# EAGLE design sme360pm (EAGLE 9.6.2)
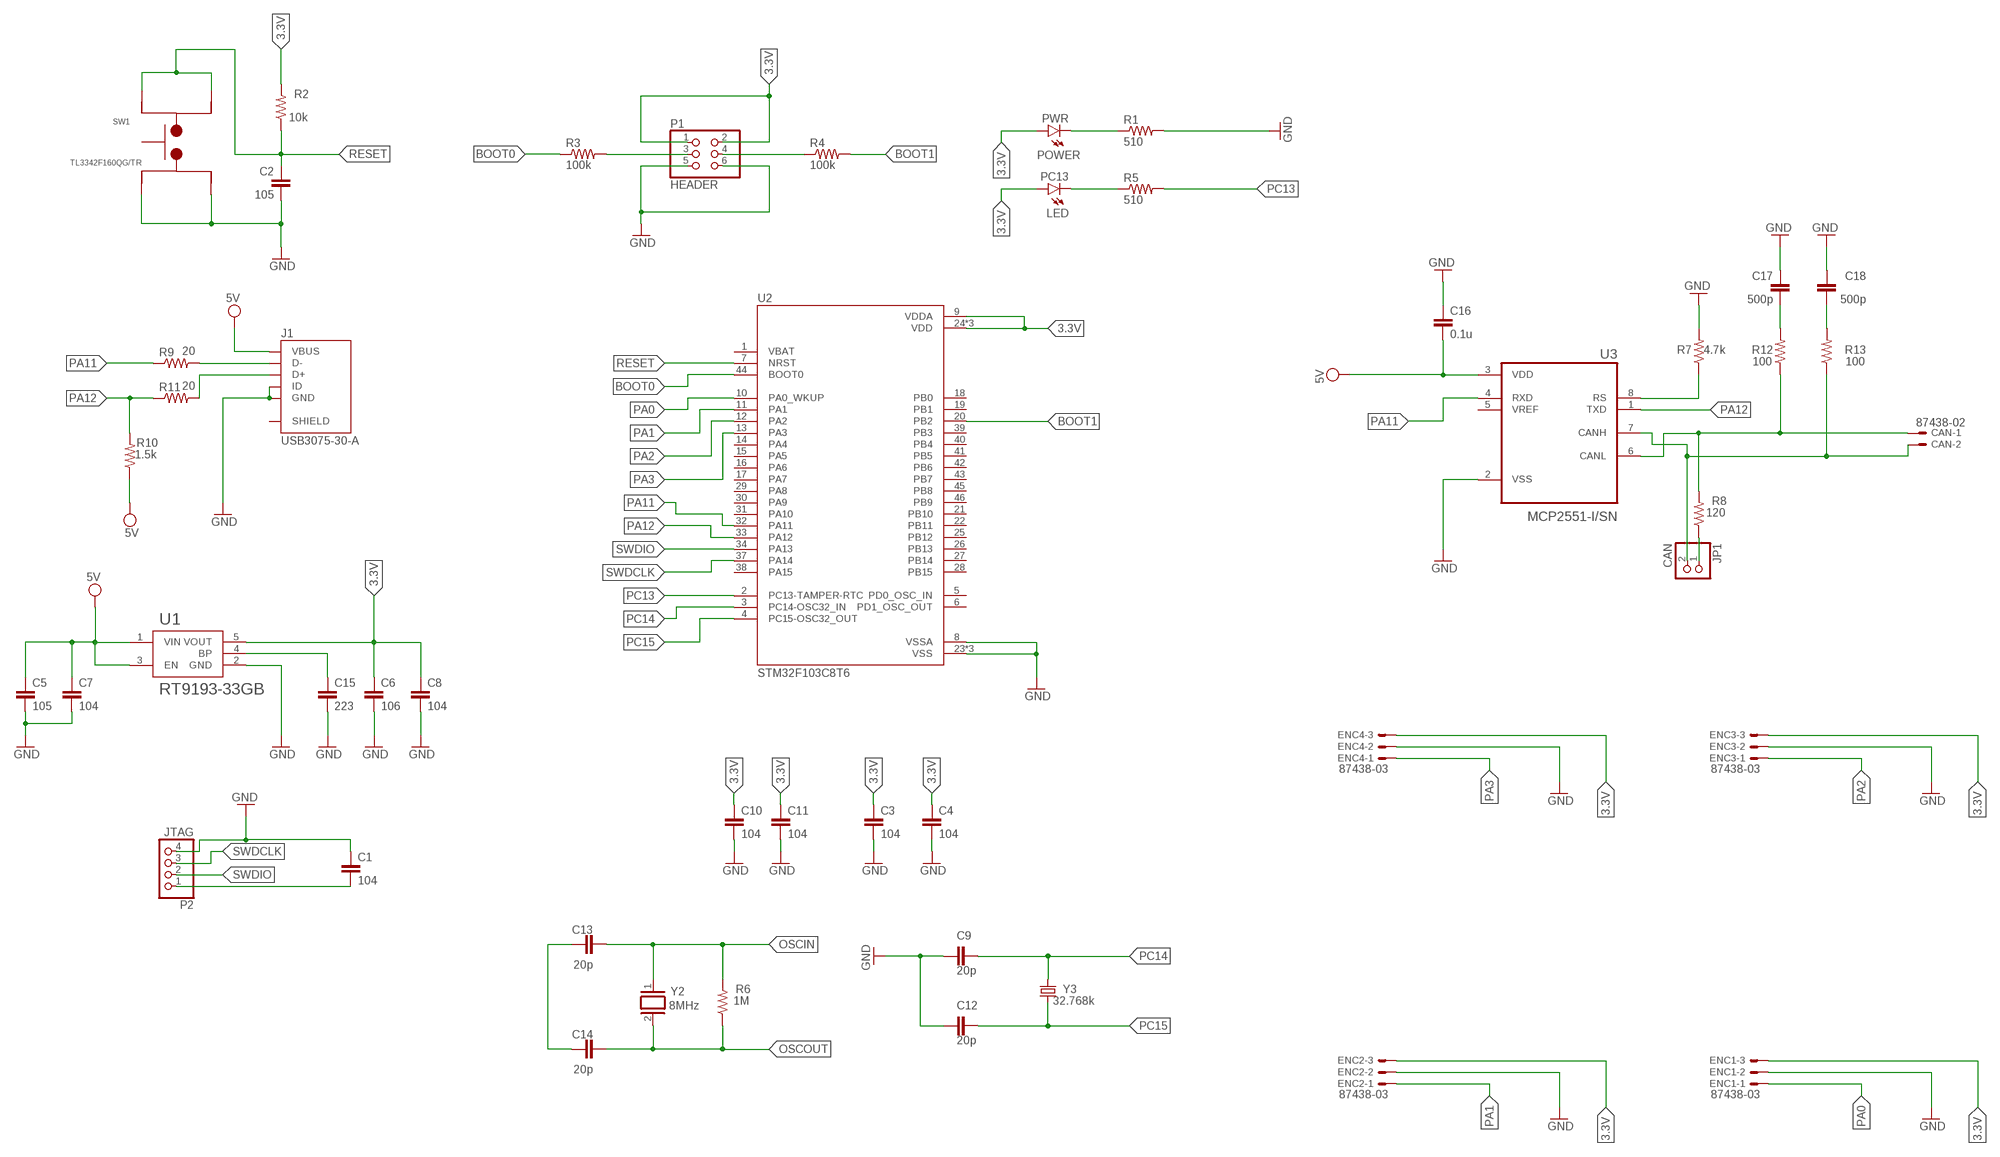
[diagram p0: schematic, sheet 1]

## Parts
C1  104  C-EUC0603  [C0603]
C2  105  C-EUC0603  [C0603]
C3  104  C-EUC0603  [C0603]
C4  104  C-EUC0603  [C0603]
C5  105  C-EUC0805  [C0805]
C6  106  C-EUC0805  [C0805]
C7  104  C-EUC0603  [C0603]
C8  104  C-EUC0603  [C0603]
C9  20p  C-EUC0603  [C0603]
C10  104  C-EUC0603  [C0603]
C11  104  C-EUC0603  [C0603]
C12  20p  C-EUC0603  [C0603]
C13  20p  C-EUC0603  [C0603]
C14  20p  C-EUC0603  [C0603]
C15  223  C-EUC0603  [C0603]
C16  0.1u  C-EUC0603  [C0603]
C17  500p  C-EUC0603  [C0603]
C18  500p  C-EUC0603  [C0603]
CAN  87438-02  [87438-02]
ENC1  87438-03  [87438-03]
ENC2  87438-03  [87438-03]
ENC3  87438-03  [87438-03]
ENC4  87438-03  [87438-03]
J1  USB3075-30-A  [GCT_USB3075-30-A]
JP1  CAN  PINHD-1X2  [1X02]
P1  HEADER  PINHD-2X3  [2X03]
P2  JTAG  PINHD-1X4  [1X04]
PC13  LED  LEDCHIP-LED0603  [CHIP-LED0603]
PWR  POWER  LEDCHIP-LED0603  [CHIP-LED0603]
R1  510  R-US_R0603  [R0603]
R2  10k  R-US_R0603  [R0603]
R3  100k  R-US_R0603  [R0603]
R4  100k  R-US_R0603  [R0603]
R5  510  R-US_R0603  [R0603]
R6  1M  R-US_R0603  [R0603]
R7  4.7k  R-US_R0603  [R0603]
R8  120  R-US_R0805  [R0805]
R9  20  R-US_R0603  [R0603]
R10  1.5k  R-US_R0603  [R0603]
R11  20  R-US_R0603  [R0603]
R12  100  R-US_R0603  [R0603]
R13  100  R-US_R0603  [R0603]
SW1  TL3342F160QG/TR  [SW_TL3342F160QG/TR]
U1  RT9193-33GB  [SOT94P279X129-5N]
U2  STM32F103C8T6  [QFP50P900X900X160-48N]
U3  MCP2551-I/SN  [SOIC127P599X175-8N]
Y2  8MHz  XTAL/S  [QS]
Y3  32.768k  KX-327-S  [8.2X3.8]

## Nets
3.3V: C3.1 C4.1 C6.1 C8.1 C10.1 C11.1 ENC1.3 ENC2.3 ENC3.3 ENC4.3 P1.1 P1.2 PC13.A PWR.A R2.2 U1.5(VOUT) U2.9(VDDA) U2.24(VDD) U2.36(VDD) U2.48(VDD)
BOOT0: R3.1 U2.44(BOOT0)
BOOT1: R4.2 U2.20(PB2)
GND: C1.1 C2.1 C3.2 C4.2 C5.2 C6.2 C7.2 C8.2 C9.2 C10.2 C11.2 C12.2 C15.2 C16.1 C17.2 C18.2 ENC1.2 ENC2.2 ENC3.2 ENC4.2 J1.4(ID) J1.5(GND) P1.5 P1.6 P2.4 R1.2 R7.2 SW1.1 SW1.2 U1.2(GND) U2.8(VSSA) U2.23(VSS) U2.35(VSS) U2.47(VSS) U3.2(VSS)
N$1: J1.2(D-) R9.2
N$2: J1.3(D+) R11.2
N$3: PWR.C R1.1
N$4: C15.1 U1.4(BP)
N$5: C13.1 C14.1
N$6: PC13.C R5.1
N$7: C1.2 P2.1
N$8: P1.3 R3.2
N$9: P1.4 R4.1
N$10: R7.1 U3.8(RS)
N$11: CAN.1 R8.2 R12.1 U3.6(CANL)
N$12: JP1.1 R8.1
N$13: CAN.2 JP1.2 R13.1 U3.7(CANH)
N$14: C17.1 R12.2
N$15: C18.1 R13.2
OSCIN: C13.2 R6.2 Y2.1
OSCOUT: C14.2 R6.1 Y2.2
PA0: ENC1.1 U2.10(PA0_WKUP)
PA1: ENC2.1 U2.11(PA1)
PA2: ENC3.1 U2.12(PA2)
PA3: ENC4.1 U2.13(PA3)
PA11: R9.1 U2.32(PA11) U3.4(RXD)
PA12: R10.2 R11.1 U2.33(PA12) U3.1(TXD)
PC13: R5.2 U2.2(PC13-TAMPER-RTC)
PC14: C9.1 U2.3(PC14-OSC32_IN) Y3.4
PC15: C12.1 U2.4(PC15-OSC32_OUT) Y3.1
RESET: C2.2 R2.1 SW1.3 SW1.4 U2.7(NRST)
SWDCLK: P2.3 U2.37(PA14)
SWDIO: P2.2 U2.34(PA13)
VCC: C5.1 C7.1 C16.2 J1.1(VBUS) R10.1 U1.1(VIN) U1.3(EN) U3.3(VDD) ; supply symbol labelled 5V
Unconnected: J1.S1(SHIELD) J1.S2(SHIELD) J1.S3(SHIELD) J1.S4(SHIELD) J1.S5(SHIELD) J1.S6(SHIELD) U2.1(VBAT) U2.5(PD0_OSC_IN) U2.6(PD1_OSC_OUT) U2.14(PA4) U2.15(PA5) U2.16(PA6) U2.17(PA7) U2.18(PB0) U2.19(PB1) U2.21(PB10) U2.22(PB11) U2.25(PB12) U2.26(PB13) U2.27(PB14) U2.28(PB15) U2.29(PA8) U2.30(PA9) U2.31(PA10) U2.38(PA15) U2.39(PB3) U2.40(PB4) U2.41(PB5) U2.42(PB6) U2.43(PB7) U2.45(PB8) U2.46(PB9) U3.5(VREF)

## Library data of the parts
C1-C18 = rcl:C-EU: CAPACITOR, European symbol; SPICEPREFIX: C
CAN = con-molex:87438-02: Wire-to-Board 1.50mm (.059") Pitch Header - Right Angle, SMT, Shrouded Source: http://www.molex.com/product/micro/87438.html; MF: MOLEX; OC_FARNELL: 1711327; OC_NEWARK: unknown
ENC1-ENC4 = con-molex:87438-03: Wire-to-Board 1.50mm (.059") Pitch Header - Right Angle, SMT, Shrouded Source: http://www.molex.com/product/micro/87438.html; MF: MOLEX; OC_FARNELL: 1711328; OC_NEWARK: unknown
J1 = USB3075-30-A:USB3075-30-A: Micro USB Receptacle, Type B, 5 Pin, SMT, Horizontal, Bottom Mount (Standart), without Peg, with Outer Shell Stakes Check availability <https://pricing.snapeda.com/parts/USB3075-30-A/Global%20Connector%20Technology/view-part?ref=eda>; AVAILABILITY: In Stock; DESCRIPTION: USB - micro B USB 2.0 Receptacle Connector 5 Position Surface Mount, Right Angle; Through Hole, 2.35mm profile, 5 Pins, Horizontal, Bottom mount; MF: Global Connector Technology; MP: USB3075-30-A; PACKAGE: None; PRICE: None; PURCHASE-URL: https://pricing.snapeda.com/search/part/USB3075-30-A/?ref=eda
JP1 = pinhead:PINHD-1X2: PIN HEADER
P1 = pinhead:PINHD-2X3: PIN HEADER
P2 = pinhead:PINHD-1X4: PIN HEADER
PC13 PWR = led:LED: LED OSRAM: - CHIPLED LG R971, LG N971, LY N971, LG Q971, LY Q971, LO R971, LY R971 LH N974, LH R974 LS Q976, LO Q976, LY Q976 LO Q996 - Hyper CHIPLED LW Q18S LB Q993, LB Q99A, LB R99A - SideLED LS A670, LO A670, LY A670, LG A670, LP A670 LB A673, LV A673, LT A673, LW A673 LH A674 LY A675 LS A676, LA A676, LO A676, LY A676, LW A676 LS A679, LY A679, LG A679 - Hyper Micro SIDELED® LS Y876, LA Y876, LO Y876, LY Y876 LT Y87S - SmartLED LW L88C, LW L88S LB L89C, LB L89S, LG L890 LS L89K, LO L89K, LY L89K LS L896, LA L896, LO L896, LY L896 - TOPLED LS T670, LO T670, LY T670, LG T670, LP T670 LSG T670, LSP T670, LSY T670, LOP T670, LYG T670 LG T671, LOG T671, LSG T671 LB T673, LV T673, LT T673, LW T673 LH T674 LS T676, LA T676, LO T676, LY T676, LB T676, LH T676, LSB T676, LW T676 LB T67C, LV T67C, LT T67C, LS T67K, LO T67K, LY T67K, LW E67C LS E67B, LA E67B, LO E67B, LY E67B, LB E67C, LV E67C, LT E67C LW T67C LS T679, LY T679, LG T679 LS T770, LO T770, LY T770, LG T770, LP T770 LB T773, LV T773, LT T773, LW T773 LH T774 LS E675, LA E675, LY E675, LS T675 LS T776, LA T776, LO T776, LY T776, LB T776 LHGB T686 LT T68C, LB T68C - Hyper Mini TOPLED® LB M676 - Mini TOPLED Santana® LG M470 LS M47K, LO M47K, LY M47K Source: http://www.osram.convergy.de LUXEON: - LUMILED® LXK2-PW12-R00, LXK2-PW12-S00, LXK2-PW14-U00, LXK2-PW14-V00 LXK2-PM12-R00, LXK2-PM12-S00, LXK2-PM14-U00 LXK2-PE12-Q00, LXK2-PE12-R00, LXK2-PE12-S00, LXK2-PE14-T00, LXK2-PE14-U00 LXK2-PB12-K00, LXK2-PB12-L00, LXK2-PB12-M00, LXK2-PB14-N00, LXK2-PB14-P00, LXK2-PB14-Q00 LXK2-PR12-L00, LXK2-PR12-M00, LXK2-PR14-Q00, LXK2-PR14-R00 LXK2-PD12-Q00, LXK2-PD12-R00, LXK2-PD12-S00 LXK2-PH12-R00, LXK2-PH12-S00 LXK2-PL12-P00, LXK2-PL12-Q00, LXK2-PL12-R00 Source: www.luxeon.com KINGBRIGHT: KA-3528ASYC Source: www.kingbright.com
R1-R13 = rcl:R-US_: RESISTOR, American symbol; SPICEPREFIX: R
SW1 = TL3342F160QG_TR:TL3342F160QG/TR: TL3342 Series SPST 1.6 N Round Button Gull Wing Surface Mount Tactile Switch Check availability <https://pricing.snapeda.com/parts/TL3342F160QG/TR/E-Switch/view-part?ref=eda>; AVAILABILITY: In Stock; DESCRIPTION: Tactile Switch SPST-NO Top Actuated Surface Mount; MF: E-Switch; MP: TL3342F160QG/TR; PACKAGE: None; PRICE: None; PURCHASE-URL: https://pricing.snapeda.com/search/part/TL3342F160QG/TR/?ref=eda
U1 = RT9193-33GB:RT9193-33GB: RT9193 Series 300 mA 3.3 V Ultra-Low Noise Ultra-Fast CMOS LDO Regulator-SC-70-5 Check availability <https://pricing.snapeda.com/parts/RT9193-33GB/Richtek%20USA%20Inc./view-part?ref=eda>; AVAILABILITY: In Stock; DESCRIPTION: Linear Voltage Regulator IC Positive Fixed 1 Output 300mA SOT-23-5; MF: Richtek USA Inc.; MP: RT9193-33GB; PACKAGE: SOT-23-5 Richtek; PRICE: None; PURCHASE-URL: https://pricing.snapeda.com/search/part/RT9193-33GB/?ref=eda
U2 = STM32F103C8T6:STM32F103C8T6: Mainstream Performance line, ARM Cortex-M3 MCU with 64 Kbytes Flash, 72 MHz CPU, motor control, USB and CAN Check availability <https://pricing.snapeda.com/parts/STM32F103C8T6/STMicroelectronics/view-part?ref=eda>; AVAILABILITY: In Stock; DESCRIPTION: ARM® Cortex®-M3 STM32F1 Microcontroller IC 32-Bit 72MHz 64KB (64K x 8) FLASH 48-LQFP (7x7); MF: STMicroelectronics; MP: STM32F103C8T6; PACKAGE: LQFP-48 STMicroelectronics; PRICE: None; PURCHASE-URL: https://pricing.snapeda.com/search/part/STM32F103C8T6/?ref=eda
U3 = MCP2551-I_SN:MCP2551-I/SN: Check availability <https://pricing.snapeda.com/parts/MCP2551-I/SN/Microchip/view-part?ref=eda>; AVAILABILITY: In Stock; DESCRIPTION: 1/1 Transceiver Half CANbus 8-SOIC; MF: Microchip; MP: MCP2551-I/SN; PACKAGE: SOIC-8 Microchip; PRICE: None; PURCHASE-URL: https://pricing.snapeda.com/search/part/MCP2551-I/SN/?ref=eda
Y2 = special:XTAL/S: CRYSTAL
Y3 = crystal-geyer_V1_0:KX-327: Tuning Fork Crystals (kHz) SMD: KX327 - Serie Model Size l/w/h [mm] Frequency Range Frequency Stability Temp. Range [°C] Load Capacitance AECQ 200 availabel Datasheet KX-327VT KX-327FT KX-327RT KX-327NHT KX-327NHF KX-327L KX-327S 1.25/1.05/0.5 1.6/1.0/0.5 2.0/1.2/0.6 3.2/1.5/0.8 3.2/1.5/0.8 7.0/1.5/1.4 8.2/3.8/2.5 32,768 kHz 32,768 kHz 32,768 kHz 32,768 kHz 32,768 kHz 32,768 kHz 32,768 kHz ±10 … ±20ppm ±10 … ±20ppm ±10 … ±20ppm ±10 … ±20ppm ±10 … ±20ppm ±10 … ±20ppm ±5 … ±20ppm (*) -40°C …+85°C (*) -40°C …+85°C (*) -40°C …+85°C (*) -40°C …+85°C (*) -40°C …+125°C (*) -40°C …+85°C (*) -40°C …+85°C 7/9/12,5 7/9/12,5 7/9/12,6 7/9/12,5 9/12,5 7/9/12,5 6/12,5 - - - - yes - - KX-327VT.pdf <http://www.geyer-electronic.de/uploads/tx_userartikelfrequenz/GEYER-KX-327VT.pdf> KX-327FT.pdf <http://www.geyer-electronic.de/uploads/tx_userartikelfrequenz/GEYER-KX-327FT.pdf> KX-327RT.pdf <http://www.geyer-electronic.de/uploads/tx_userartikelfrequenz/GEYER-KX-327RT.pdf> KX-327NHT.pdf <http://www.geyer-electronic.de/uploads/tx_userartikelfrequenz/GEYER-KX-327NHT.pdf> KX-327NHF.pdf <http://www.geyer-electronic.de/uploads/tx_userartikelfrequenz/GEYER-KX-327NHF.pdf> KX-327L.pdf <http://www.geyer-electronic.de/uploads/tx_userartikelfrequenz/GEYER-KX-327L.pdf> KX-327S.pdf <http://www.geyer-electronic.de/uploads/tx_userartikelfrequenz/GEYER-KX-327S.pdf> <http://www.geyer-electronic.de/fileadmin/template/img/logo-geyer-electronic.png> Details see: http://www.geyer-electronic.de/Frequenz-Produkte.9.0.html Created 2016-06-07, Hans Locher 2016 (C) Geyer Quartz Technology KX327VT,KX327FT,KX327RT,KX327NHT,KX327NHF,KX327S,KX327L;125105;1610;2012;3215;7015;8238;1,25x1,05,1.25x1.05;1,6x1,0,1.6x1.0;2,0x1,2,2.0x1.2;3,2x1,5,3.2x1.5;8,2x3,8,8.2x3.8,7.0x1.5,7,0x1,532.768kHz

## Board
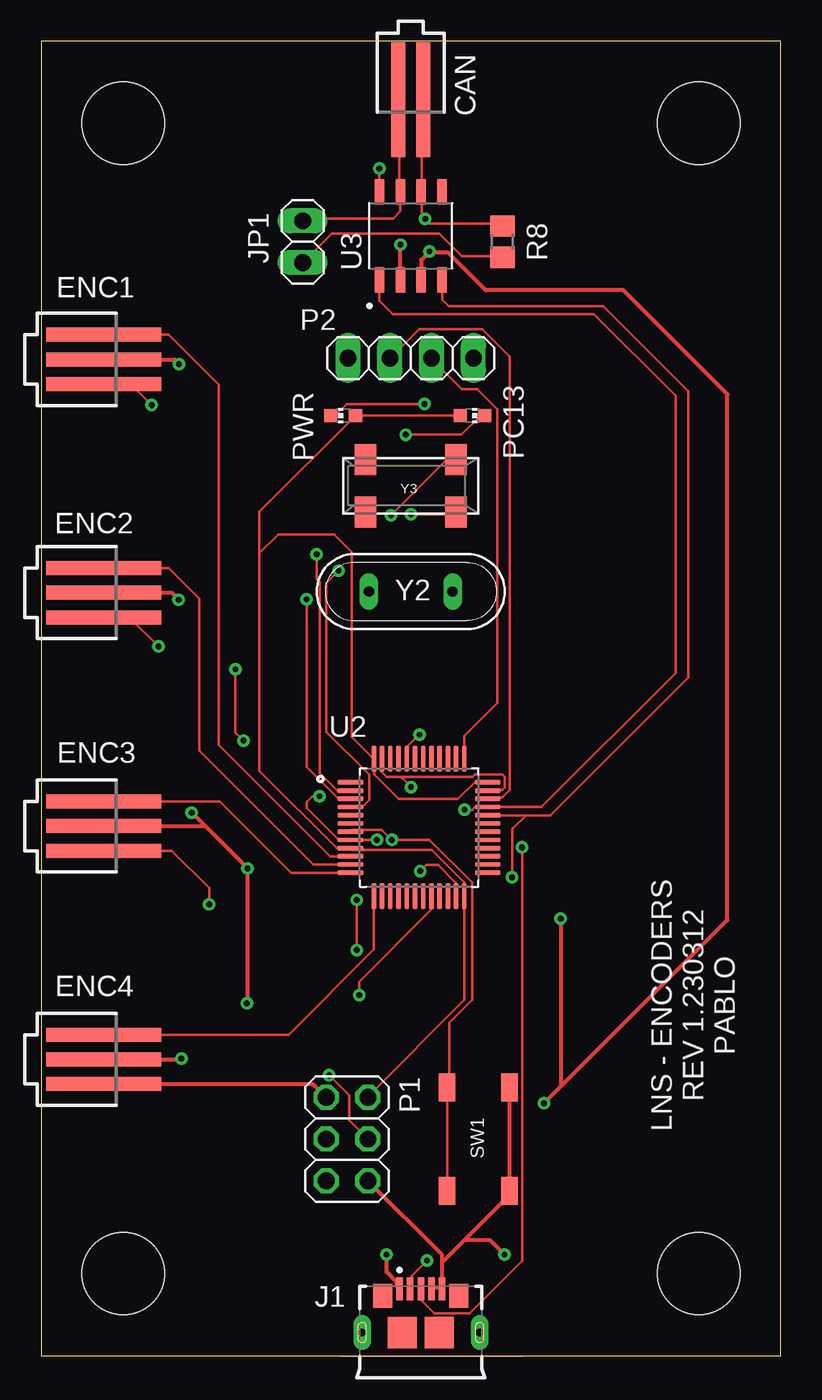
[diagram p1: board, top side]
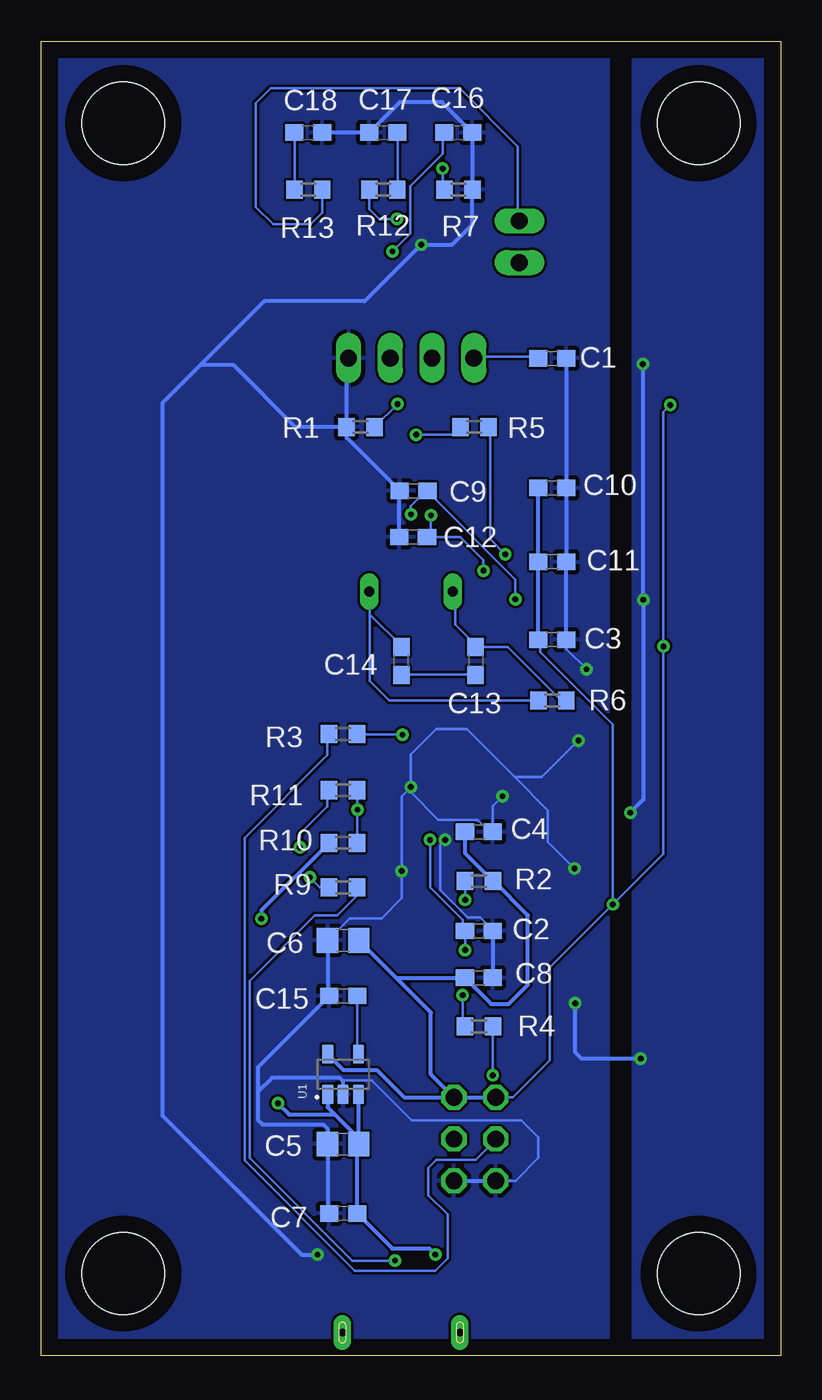
[diagram p2: board, bottom side, seen from below]

Size 45 x 80 mm. Coordinates in mm from the lower left corner, seen from the top.
Outline: 0,0 45,0 45,80 0,80 0,0
Copper layers (1*16): Top 0.035mm / dielectric 1.5mm / Bottom 0.035mm
Design rules "default": minimum track width 6mil, minimum drill 0.35mm, track to track 6mil, track to pad 6mil, pad to pad 6mil, via to via 6mil, smd to smd 6mil, copper to edge 40mil, drill to drill 6mil, minimum pad ring 10mil, minimum via ring 8mil, stop-mask expansion 4mil, vias tented up to drill 0mil, thermal gap 10mil
Holes 5 mm at 5,75 40,75 40,5 5,5

### Footprints (pad centres in the part's own frame; a part is rotated, then mirrored left to right if it is on the bottom)
C0603 = smd 1.1 x 1: 1 -0.85,0; 2 0.85,0
C0805 = smd 1.3 x 1.5: 1 -0.95,0; 2 0.95,0
87438-02 = smd 7 x 0.85: 1 0,0.75; 2 0,-0.75
87438-03 = smd 7 x 0.85: 1 0,1.5; 2 0,0; 3 0,-1.5
GCT_USB3075-30-A = smd 0.4 x 1.4: 1 0,0; 2 0.65,0; 3 1.3,0; 4 1.95,0; 5 2.6,0 | smd 1.15 x 1.45: S1 -1.02,-0.42; S2 3.62,-0.42 | smd 1.75 x 1.9: S3 0.175,-2.65; S4 2.425,-2.65 | drill 0.45 pad 1.05 long: S5 -2.275,-2.65; S6 4.875,-2.65
1X02 = drill 1.016 long: 1 -1.27,0; 2 1.27,0
2X03 = drill 1.016 octagon: 1 -2.54,-1.27; 2 -2.54,1.27; 3 0,-1.27; 4 0,1.27; 5 2.54,-1.27; 6 2.54,1.27
1X04 = drill 1.016 long: 1 -3.81,0; 2 -1.27,0; 3 1.27,0; 4 3.81,0
CHIP-LED0603 = smd 0.8 x 0.8: A 0,-0.75; C 0,0.75
R0603 = smd 1 x 1.1: 1 -0.85,0; 2 0.85,0
R0805 = smd 1.3 x 1.5: 1 -0.95,0; 2 0.95,0
SW_TL3342F160QG/TR = smd 1.7 x 1: 1 -3.15,-1.9; 2 3.15,-1.9; 3 -3.15,1.9; 4 3.15,1.9
SOT94P279X129-5N = smd 1.17 x 0.67: 1 -1.22,0.94; 2 -1.22,0; 3 -1.22,-0.94; 4 1.22,-0.94; 5 1.22,0.94
QFP50P900X900X160-48N = smd 1.56 x 0.28: 1 -4.18,2.75; 2 -4.18,2.25; 3 -4.18,1.75; 4 -4.18,1.25; 5 -4.18,0.75; 6 -4.18,0.25; 7 -4.18,-0.25; 8 -4.18,-0.75; 9 -4.18,-1.25; 10 -4.18,-1.75; 11 -4.18,-2.25; 12 -4.18,-2.75; 25 4.18,-2.75; 26 4.18,-2.25; 27 4.18,-1.75; 28 4.18,-1.25; 29 4.18,-0.75; 30 4.18,-0.25; 31 4.18,0.25; 32 4.18,0.75; 33 4.18,1.25; 34 4.18,1.75; 35 4.18,2.25; 36 4.18,2.75 | smd 0.28 x 1.56: 13 -2.75,-4.18; 14 -2.25,-4.18; 15 -1.75,-4.18; 16 -1.25,-4.18; 17 -0.75,-4.18; 18 -0.25,-4.18; 19 0.25,-4.18; 20 0.75,-4.18; 21 1.25,-4.18; 22 1.75,-4.18; 23 2.25,-4.18; 24 2.75,-4.18; 37 2.75,4.18; 38 2.25,4.18; 39 1.75,4.18; 40 1.25,4.18; 41 0.75,4.18; 42 0.25,4.18; 43 -0.25,4.18; 44 -0.75,4.18; 45 -1.25,4.18; 46 -1.75,4.18; 47 -2.25,4.18; 48 -2.75,4.18
SOIC127P599X175-8N = smd 1.58 x 0.6: 1 -2.67,1.905; 2 -2.67,0.635; 3 -2.67,-0.635; 4 -2.67,-1.905; 5 2.67,-1.905; 6 2.67,-0.635; 7 2.67,0.635; 8 2.67,1.905
QS = drill 0.61 long: 1 -2.54,0; 2 2.54,0
8.2X3.8 = smd 1.3 x 1.9: 1 -2.75,-1.6; 2 2.75,-1.6; 3 2.75,1.6; 4 -2.75,1.6

### Placement (x,y rotation side)
C1  13.91,60.7 180 bottom
C2  18.36,25.85 180 bottom
C3  13.9,43.58 0 bottom
C4  18.36,31.88 0 bottom
C5  26.63,12.89 180 bottom
C6  26.63,25.27 180 bottom
C7  26.63,8.66 180 bottom
C8  18.36,23 0 bottom
C9  22.34,52.64 180 bottom
C10  13.9,52.8 0 bottom
C11  13.9,48.31 0 bottom
C12  22.37,49.82 180 bottom
C13  18.56,42.28 90 bottom
C14  23.08,42.28 90 bottom
C15  26.63,21.9 180 bottom
C16  19.62,74.43 180 bottom
C17  24.18,74.43 180 bottom
C18  28.75,74.43 0 bottom
CAN  22.49,76.42 270 top
ENC1  3.81,60.63 0 top
ENC2  3.81,46.43 0 top
ENC3  3.81,32.23 0 top
ENC4  3.81,18.03 0 top
J1  21.8,4.06 0 top
JP1  15.91,67.79 90 top
P1  18.61,13.18 270 top
P2  22.49,60.71 0 top
PC13  26.24,57.21 270 top
PWR  18.38,57.21 90 top
R1  25.57,56.52 180 bottom
R2  18.36,28.88 0 bottom
R3  26.63,37.84 180 bottom
R4  18.36,20.04 180 bottom
R5  18.65,56.52 0 bottom
R6  13.9,39.87 0 bottom
R7  19.62,70.96 0 bottom
R8  28.06,67.79 90 top
R9  26.63,28.49 0 bottom
R10  26.63,31.22 0 bottom
R11  26.63,34.41 180 bottom
R12  24.18,70.96 0 bottom
R13  28.75,70.96 180 bottom
SW1  26.6,13.18 90 top
U1  26.63,17.13 90 bottom
U2  22.99,32.14 0 top
U3  22.49,68.15 90 top
Y2  22.49,46.5 0 top
Y3  22.49,52.94 180 top

### Tracks (layer width: path | path; a pad name or v marks a point on that pad's centre or on a via)
3.3V  (via drill 0.35)
  Top 0.152: PC13.A PWR.A 13.29,51.36 13.29,48.85 | ENC3.3 7.95,30.73 10.22,28.46 v10.22,27.46 | ENC2.3 5.38,44.93 v7.14,43.16 | ENC1.3 5.45,59.13 v6.73,57.85 | U2.36 27.13,34.9 26.36,34.9 25.34,33.87 21.75,33.87 20.27,35.36 20.27,36.27 U2.48 20.12,36.42 18.89,37.65 18.89,48.92 17.83,49.98 14.42,49.98 13.29,48.85 | P1.2 19.96,15.85 25.76,21.64 25.76,27.89 U2.24 25.76,28.04 25.76,28.8 23.77,30.79 18.9,30.79 U2.9 17.98,30.9 13.29,35.59 13.29,48.85
  Top 0.254: ENC4.3 16.54,16.53 P1.1
  Bottom 0.152: v10.22,27.46 14.05,23.64 14.05,17.98 16.31,15.72 P1.1 | v10.22,27.46 7.14,30.54 v7.14,43.16 7.14,57.44 v6.73,57.85 | v10.22,27.46 10.22,38.42 14.63,42.82 14.63,43.43 C3.1
  Bottom 0.254: P1.2 P1.1 | U1.5 26.61,17.39 24.58,17.39 22.92,15.72 P1.2 | C10.1 C11.1 C3.1 | C4.1 19.21,30.58 R2.2 17.46,28.88 15.39,26.8 15.39,22.58 16.56,21.41 17.62,21.41 C8.1 23.41,23 C6.1 21.29,20.89 21.29,17.14 P1.2
BOOT0  (via drill 0.35)
  Top 0.152: v23.01,37.8 22.25,37.03 22.25,36.42 U2.44
  Bottom 0.152: v23.01,37.8 25.76,37.8 R3.1
BOOT1  (via drill 0.35)
  Top 0.152: v19.36,21.95 19.36,22.76 23.74,27.15 U2.20 | U2.20
  Bottom 0.152: v19.36,21.95 19.36,20.12 R4.2
GND  (via drill 0.35)
  Top 0.152: 21.96,35.2 26.21,35.2 26.36,35.36 28.04,35.36 28.19,35.2 28.19,34.59 28.04,34.44 27.28,34.44 U2.35 | 21.96,35.2 21.03,35.2 20.73,35.51 20.73,36.27 U2.47 | v20.42,31.39 18.9,31.39 U2.8 18.11,31.4 16.16,33.34 16.16,33.7 16.51,34.04 v16.93,34.04 | 21.96,35.2 21.96,35.16 v22.51,34.61 | J1.4 23.77,4.12 24.38,4.12 J1.5 | U2.23 25.24,28.78 24.16,29.86 23.42,29.86 v23.07,29.5 | v11.82,41.78 11.82,37.93 v12.32,37.44
  Top 0.254: J1.5 24.4,5.69 | 24.4,5.69 25.74,7.03 | 25.74,7.03 28.5,9.78 SW1.1 SW1.2 | 24.4,5.69 24.4,6.13 P1.6 | U3.2 21.85,67.59 v21.87,67.61 | ENC3.2 9.96,32.23 9.97,32.24 | 9.97,32.24 | 9.97,32.24 v12.56,29.65 12.56,21.49 v12.51,21.45 | ENC4.2 8.48,18.03 v8.53,18.07 | ENC2.2 7.94,46.43 v8.37,46.01 | 9.97,32.24 v9.16,33.05 | ENC1.2 8.11,60.63 v8.39,60.34 | v28.19,6.16 27.32,7.03 25.74,7.03
  Bottom 0.152: v20.42,31.39 20.73,31.09 20.73,28.34 19.05,26.67 18.29,26.67 17.53,25.91 C2.1 | 26.63,16.7 26.52,16.76 24.89,16.76 22.46,14.34 15.8,14.34 14.75,13.29 14.75,12.03 16.14,10.64 P1.5 | C6.2 26.22,26.62 24.29,26.62 23.07,27.85 v23.07,29.5 23.07,34.05 v22.51,34.61 | v12.56,29.65 14.17,31.27 14.17,33.19 16.2,35.22 | 16.2,35.22 19.11,38.13 20.97,38.13 22.51,36.6 v22.51,34.61 | v22.51,34.61 22.51,34.29 20.83,32.61 18.44,32.61 17.83,32 17.53,32 C4.2 17.51,33.46 v16.93,34.04 | C3.2 13.05,43.01 v11.82,41.78 | v12.32,37.44 14.53,35.22 16.2,35.22
  Bottom 0.254: C2.1 C8.2 | C6.2 27.58,22 C15.2 31.81,17.56 31.81,16.05 | C7.2 27.58,8.76 C5.2 27.58,13.82 27.83,14.07 31.53,14.07 31.81,14.36 31.81,16.05 | U1.2 26.63,16.7 26.85,16.92 30.94,16.92 31.81,16.05 | P1.6 P1.5 | C10.2 13.05,52.55 | 13.05,52.55 C11.2 C3.2 | C1.1 13.06,52.55 13.05,52.55 | C18.2 C17.2 23.18,76.28 20.62,76.28 C16.1 R7.2 18.77,68.84 20,67.61 v21.87,67.61 25.31,64.17 31.41,64.17 35.31,60.27 | R1.2 26.42,60.59 P2.4 | C12.2 23.22,52.61 C9.2 26.42,55.86 R1.2 | v12.51,21.45 12.51,18.47 12.12,18.07 v8.53,18.07 | v9.16,33.05 8.37,33.84 v8.37,46.01 8.39,46.04 v8.39,60.34 | 35.31,60.27 37.62,57.96 37.62,14.62 29.15,6.16 v28.19,6.16 | R1.2 29.53,56.52 33.28,60.27 35.31,60.27
  pour Bottom: 10.5,80 45,80 45,0 10.5,0
  pour Bottom: 0,80 9,80 9,1 9,0 0,0
N$1  (via drill 0.35)
  Top 0.152: v23.47,5.79 22.55,4.88 22.55,4.12 J1.2
  Bottom 0.152: R9.2 25.78,28 26.99,26.79 28.34,26.79 32.31,22.82 32.31,12.04 26.06,5.79 v23.47,5.79
N$2  (via drill 0.35)
  Top 0.152: v29.26,30.94 29.26,5.79 26.06,2.59 23.93,2.59 23.16,3.35 23.16,3.96 J1.3
  Bottom 0.152: v29.26,30.94 29.26,31.76 27.58,33.44 27.58,34.29 R11.2
N$3  (via drill 0.35)
  Top 0.152: v23.32,57.91 18.59,57.91 17.98,57.3 17.68,57.3 PWR.C
  Bottom 0.152: v23.32,57.91 24.69,56.54 R1.1
N$4
  Bottom 0.152: C15.1 25.76,21.79 25.76,18.44 U1.4
N$5
  Bottom 0.152: C13.1 18.59,41.45 23.01,41.45 C14.1
N$6  (via drill 0.35)
  Top 0.152: v22.18,56.05 25.57,56.05 26.67,57.15 26.98,57.15 PC13.C
  Bottom 0.152: R5.1 19.97,56.05 v22.18,56.05
N$7
  Bottom 0.152: C1.2 14.78,60.81 18.59,60.81 P2.1
N$8
  Bottom 0.152: R3.2 27.58,37.8 27.58,36.55 32.61,31.52 32.61,11.89 25.91,5.18 21.03,5.18 20.27,5.94 20.27,8.61 21.43,9.78 21.43,11.43 20.95,11.91 18.57,11.91 17.37,13.11 P1.3
N$9  (via drill 0.35)
  Top 0.152: v17.53,17.07 18.75,15.85 18.75,14.33 19.81,13.26 P1.4
  Bottom 0.152: v17.53,17.07 17.53,19.96 R4.1
N$10  (via drill 0.35)
  Top 0.152: v20.57,72.24 20.57,70.87 U3.8
  Bottom 0.152: v20.57,72.24 20.57,71.02 R7.1
N$11  (via drill 0.35)
  Top 0.152: R8.2 28.04,68.89 23.65,68.89 v23.36,69.18 23.16,69.37 23.16,70.71 23.16,70.72 U3.6 23.16,70.87 23.16,76.35 CAN.1
  Bottom 0.152: R12.1 25.03,69.77 24.44,69.18 v23.36,69.18
N$12
  Top 0.152: R8.1 28.04,66.9 25.6,66.9 24.23,68.28 17.68,68.28 16,66.6 JP1.1
N$13
  Top 0.152: CAN.2 21.79,76.35 21.79,70.87 U3.7 21.85,69.63 21.41,69.19 16,69.19 JP1.2
  Bottom 0.152: JP1.2 16,69.19 16,73.59 19.54,77.12 31.03,77.12 31.93,76.22 31.93,69.9 30.88,68.85 28.6,68.85 27.9,69.55 R13.1
N$14
  Bottom 0.152: R12.2 23.32,71.02 23.32,74.37 C17.1
N$15
  Bottom 0.152: R13.2 29.57,71.02 29.57,74.37 C18.1
OSCIN
  Bottom 0.152: R6.2 13.11,39.93 13.41,39.93 16.61,43.13 18.44,43.13 C13.2 18.59,43.28 19.81,44.5 19.81,46.48 Y2.1
OSCOUT
  Bottom 0.152: 24.99,45.11 24.99,46.48 Y2.2 | 24.99,45.11 23.16,43.28 C14.2 | 24.99,45.11 24.99,41.05 23.82,39.87 R6.1
PA0
  Top 0.152: U2.10 17.59,30.39 10.81,37.17 10.81,59.09 7.77,62.13 ENC1.1
PA1
  Top 0.152: ENC2.1 7.76,47.93 9.61,46.08 9.61,36.84 16.56,29.89 U2.11
PA2
  Top 0.152: ENC3.1 10.87,33.73 15.21,29.39 U2.12
PA3
  Top 0.152: ENC4.1 15.06,19.53 20.24,24.71 U2.13
PA11  (via drill 0.35)
  Top 0.152: U3.4 24.39,64.28 24.8,63.87 34.2,63.87 39.36,58.71 39.36,41.27 30.98,32.89 29.51,32.89 | 29.51,32.89 28.65,32.89 U2.32 | v28.65,29.11 28.65,32.04 28.72,32.11 29.51,32.89
  Bottom 0.152: v28.65,29.11 28.04,28.5 27.58,28.5 R9.1
PA12  (via drill 0.35)
  Top 0.152: U3.1 20.58,64.2 21.39,63.39 33.63,63.39 38.59,58.42 38.59,41.55 30.43,33.39 U2.33 27.13,33.38 26.36,33.38 26.21,33.22 v25.76,33.22
  Bottom 0.152: R10.2 25.76,31.24 v25.76,33.22 25.76,34.29 R11.1
PC13  (via drill 0.35)
  Top 0.152: v16.76,48.77 16.76,47.27 16.94,47.09 16.94,35.47 18.01,34.4 18.8,34.4 U2.2
  Bottom 0.152: v16.76,48.77 17.68,49.68 17.68,56.39 R5.2
PC14  (via drill 0.35)
  Top 0.152: Y3.4 25.1,51.2 v22.5,51.2 | v16.15,46.03 16.15,35.82 18.07,33.9 U2.3
  Bottom 0.152: v22.5,51.2 22.5,51.72 21.64,52.58 C9.1 21.49,52.58 16.15,47.24 v16.15,46.03
PC15  (via drill 0.35)
  Top 0.152: v21.29,51.15 24.55,54.41 25.15,54.41 Y3.1 | v18.09,47.77 17.36,47.03 17.36,37.97 19.96,35.36 19.96,33.83 19.51,33.38 18.9,33.38 U2.4
  Bottom 0.152: v21.29,51.15 21.29,50.06 C12.1 19.49,49.82 18.09,48.42 v18.09,47.78 v18.09,47.77
RESET  (via drill 0.35)
  Top 0.152: SW1.3 SW1.4 24.84,16.46 24.84,20.27 26.21,21.64 26.21,28.8 23.62,31.39 v21.34,31.39 20.73,32 18.9,32 U2.7 | v19.2,24.69 v19.2,27.74
  Bottom 0.152: v21.34,31.39 21.34,28.5 19.36,26.52 19.36,25.91 C2.2 19.2,25.76 v19.2,24.69 | v19.2,27.74 19.2,28.8 R2.1
SWDCLK
  Top 0.152: P2.3 23.77,60.66 25.6,58.83 26.52,58.83 27.74,57.61 27.74,47.6 27.74,47.4 27.74,39.71 25.74,37.72 U2.37
SWDIO
  Top 0.152: U2.34 27.28,33.98 28.04,33.98 28.5,34.44 28.5,60.81 26.82,62.48 23.01,62.48 21.34,60.81 P2.2
VCC  (via drill 0.35)
  Top 0.152: v23.62,67.21 23.62,67.12
  Top 0.254: v31.61,26.59 31.61,16.38 | v30.59,15.37 31.61,16.38 | J1.1 21.63,4.23 21.63,4.48 21.02,5.1 v21.02,6.15 | U3.3 23.12,66.68 23.56,67.12 23.62,67.12 24.77,67.12 27.06,64.83 35.41,64.83 41.74,58.51 41.74,26.5 41.72,26.5 31.61,16.38
  Bottom 0.152: v23.62,67.21 22.55,68.28 22.55,71.17 20.57,73.15 20.57,74.37 C16.2
  Bottom 0.254: 25.78,12.79 C7.1 23.65,6.53 21.39,6.53 v21.02,6.15 | 25.78,12.79 C5.1 25.68,15.9 U1.3 | U1.1 27.57,15.12 27.13,14.68 | 25.78,12.79 25.78,13.33 27.13,14.68 | R10.1 31.61,27.09 v31.61,26.59 | v30.59,15.37 29.91,14.68 27.13,14.68

### Text on the board
tNames: LNS - ENCODERS / REV 1.230312 / PABLO